# Altium schematic sheet OSCILLATEUR.SchDoc
size A4
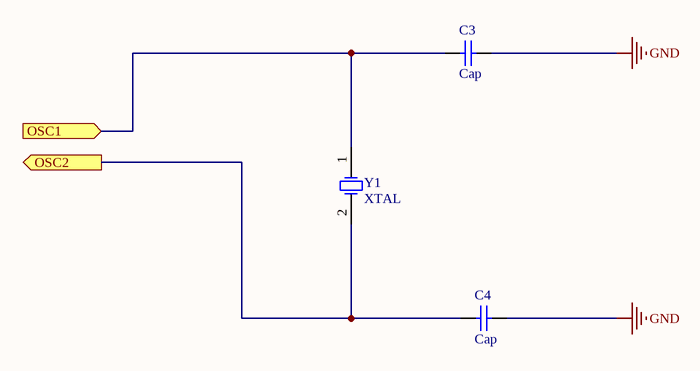
[diagram p0: OSCILLATEUR.SchDoc]

## Parts
C3  Cap  [RAD-0.3]
C4  Cap  [RAD-0.3]
Y1  XTAL  [R38]

## Ports
OSC1 (in), OSC2 (out)

## Nets
GND: C3.2 C4.2
OSC1: C3.1 Y1.1(OSC1) ; port OSC1
OSC2: C4.1 Y1.2(OSC2) ; port OSC2

## Library data of the parts
C3 = Cap: Capacitor; Value: 1pF; Published: 8-Jun-2000; LatestRevisionDate: 17-Jul-2002; LatestRevisionNote: Re-released for DXP Platform.; PackageReference: RAD-0.3; Publisher: Altium Limited; PackageDescription: Radial Cap, Thru-Hole; 2 Leads; 0.3 in Pin Spacing
C4 = Cap: Capacitor; Value: 1.5pF; Published: 8-Jun-2000; LatestRevisionDate: 17-Jul-2002; LatestRevisionNote: Re-released for DXP Platform.; PackageReference: RAD-0.3; Publisher: Altium Limited; PackageDescription: Radial Cap, Thru-Hole; 2 Leads; 0.3 in Pin Spacing
Y1 = XTAL: Crystal Oscillator; Published: 8-Jun-2000; LatestRevisionDate: 17-Jul-2002; LatestRevisionNote: Re-released for DXP Platform.; PackageReference: R38; Publisher: Altium Limited; PackageDescription: Crystal, Thru-Hole; 2 Leads; Body 3.1 x 8.2 mm (Dia.xH)